# Altium schematic sheet SHDN-CURRENT-S08-V00-5kWDetection.SchDoc: 5kW Detection / Comparison
size A3; DrawnBy: Jonn Dillon; DocumentNumber: 7; SheetNumber: 7; SheetTotal: 14; Project: Shutdown Current Board 2020
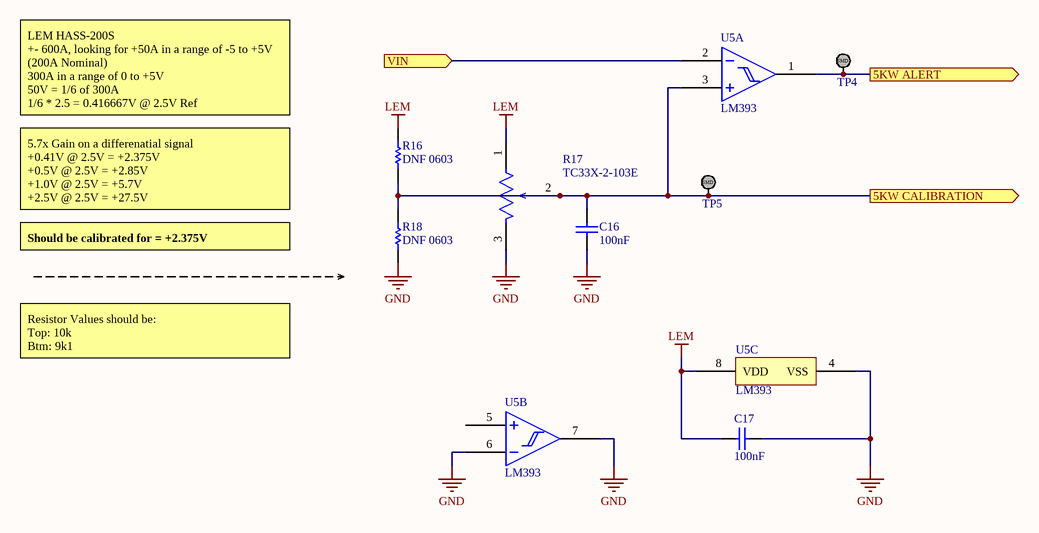
[diagram p0: SHDN-CURRENT-S08-V00-5kWDetection.SchDoc]

## Parts
C16  100nF  [Cap_Ceramic_0603]
C17  100nF  [Cap_Ceramic_0603]
R16  DNF 0603  [Res_ThinFilm_0603]
R17  TC33X-2-103E  [TC33]
R18  DNF 0603  [Res_ThinFilm_0603]
TP4  TestPoint_SMD  [TestPointSMD]  (value not drawn)
TP5  TestPoint_SMD  [TestPointSMD]  (value not drawn)
U5  LM393  [TSSOP-8]  (parts A,B,C of 3)

## Ports
5KW ALERT (out), 5KW CALIBRATION (out), VIN (in)

## Nets
GND: C16.1 C17.2 R17.3 R18.1 U5.4(VSS) U5.6(IN2-) U5.7(OUT1)
LEM: C17.1 R16.2 R17.1 U5.8(VDD)
5KW ALERT: TP4.1 U5.1(OUT1) ; port 5KW ALERT
5KW CALIBRATION: C16.2 R16.1 R17.2 R18.2 TP5.1 U5.3(IN1+) ; port 5KW CALIBRATION
VIN: U5.2(IN1-) ; port VIN

Not connected (* = marked no-connect by the designer): U5 5(IN2+)

## Notes on the sheet
- LEM HASS-200S
  +- 600A, looking for +50A in a range of -5 to +5V
  (200A Nominal)
  300A in a range of 0 to +5V
  50V = 1/6 of 300A
  1/6 * 2.5 = 0.416667V @ 2.5V Ref
- 5.7x Gain on a differenatial signal
  +0.41V @ 2.5V = +2.375V
  +0.5V @ 2.5V = +2.85V
  +1.0V @ 2.5V = +5.7V
  +2.5V @ 2.5V = +27.5V
- Should be calibrated for = +2.375V
- Resistor Values should be:
  Top: 10k
  Btm: 9k1
- Revision History:
- Sheet Title:
- Rev
- Date
- Description
- Project:
- Size:
- Drawn By:
- A3
- Number:
- Revision:
- Sheet
- Version:
- of
- QUT Motorsport
- O-120, Gardens Point
- 2 George Street
- Brisbane, QLD 4000
- Australia
- Print Date:
- Print Time:
- File Name:
- (in symbol TestPoint_SMD) SMD

## Library data of the parts
C16 C17 = 100nF 50V 5% X7R 0603: Capacitor, Ceramic, SMD, 100nF, 50V, 5%, X7R, 0603
R16 R18 = DNF 0603: Resistor, SMD, DNF, 0.1W, 0603
R17 = TC33X-2-103E: 10 kOhms 0.1W, 1/10W J Lead Surface Mount Trimmer Potentiometer Cermet 1 Turn Top Adjustment
U5 = LM393: General Purpose Comparitor 2 Circuit 8-SOIC